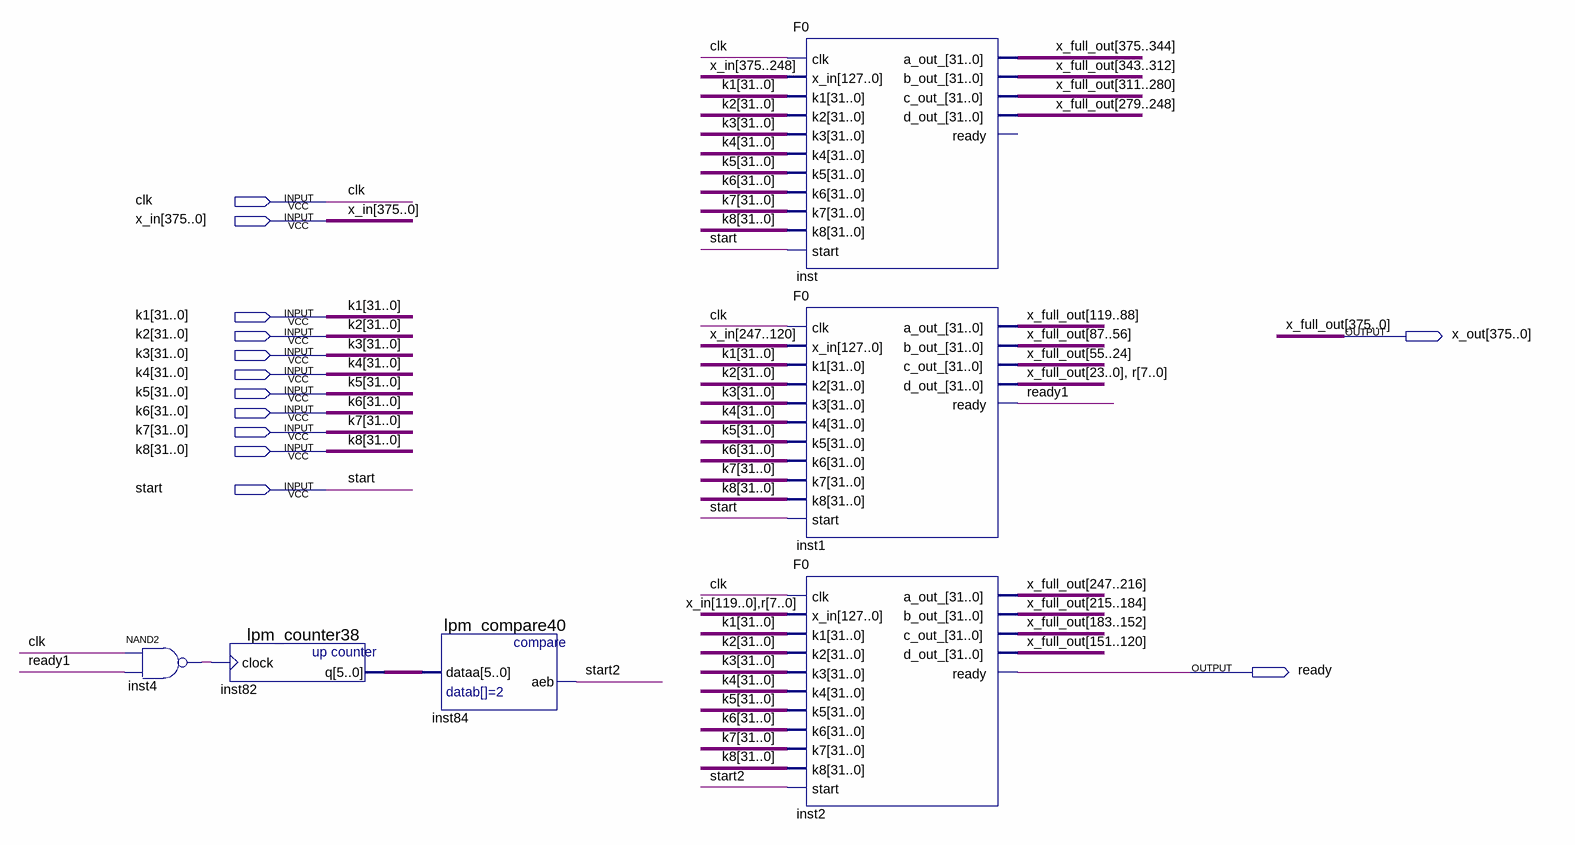
[diagram p0: schematic sheet]
// Quartus schematic nonfull_simple_f.bdf as structural Verilog: 6 symbols, 13 pins
module nonfull_simple_f (
  input  clk,
  input  [375:0] x_in,
  input  [31:0] k1,
  input  [31:0] k2,
  input  [31:0] k3,
  input  [31:0] k4,
  input  [31:0] k5,
  input  [31:0] k6,
  input  [31:0] k7,
  input  [31:0] k8,
  input  start,
  output [375:0] x_out,
  output ready
);

  wire inst4_out, ready1, start2;
  wire [5:0] inst82_q;
  wire [7:0] r;

  nand inst4 (inst4_out, clk, ready1);
  lpm_counter38 inst82 (.clock(inst4_out), .q(inst82_q));
  lpm_compare40 inst84 (.dataa(inst82_q), .aeb(start2));
  F0 inst (
    .clk(clk), .x_in(x_in[375:248]), .k1(k1), .k2(k2), .k3(k3), .k4(k4), .k5(k5), .k6(k6), .k7(k7), .k8(k8),
    .start(start), .a_out_(x_out[375:344]), .b_out_(x_out[343:312]), .c_out_(x_out[311:280]),
    .d_out_(x_out[279:248]));  // open: ready
  F0 inst1 (
    .clk(clk), .x_in(x_in[247:120]), .k1(k1), .k2(k2), .k3(k3), .k4(k4), .k5(k5), .k6(k6), .k7(k7), .k8(k8),
    .start(start), .a_out_(x_out[119:88]), .b_out_(x_out[87:56]), .c_out_(x_out[55:24]),
    .d_out_({x_out[23:0], r}), .ready(ready1));
  F0 inst2 (
    .clk(clk), .x_in({x_in[119:0], r}), .k1(k1), .k2(k2), .k3(k3), .k4(k4), .k5(k5), .k6(k6), .k7(k7),
    .k8(k8), .start(start2), .a_out_(x_out[247:216]), .b_out_(x_out[215:184]), .c_out_(x_out[183:152]),
    .d_out_(x_out[151:120]), .ready(ready));

  // Other names for the same wires on the sheet: x_full_out[375:0] = x_out
endmodule
